# Altium project bt-fpc-pvt2.PrjPcb
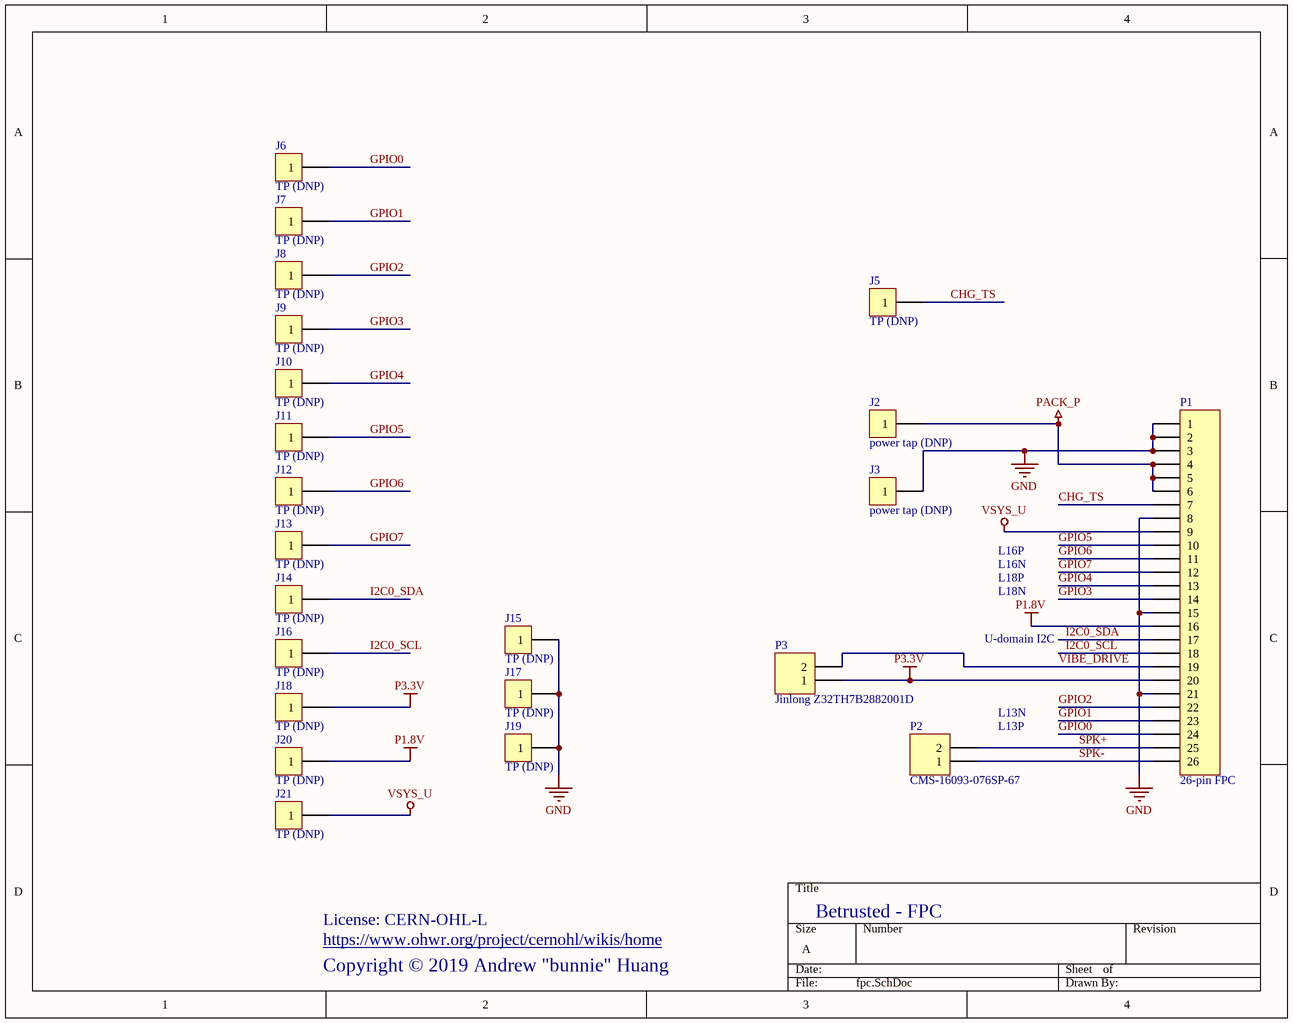
[diagram p0: fpc.SchDoc]
1 sheet, 22 parts. Net scope: global (net labels, ports and power ports of the same name join across sheets).
Board file: bt-fpc-pvt2b.PcbDoc

## Sheet fpc.SchDoc
size A

### Parts
J2  power tap (DNP)  [RESTAP-0603]
J3  power tap (DNP)  [RESTAP-0603]
J5  TP (DNP)  [TP_1.5x1_SMT]
J6  TP (DNP)  [TP_1.5x1_SMT]
J7  TP (DNP)  [TP_1.5x1_SMT]
J8  TP (DNP)  [TP_1.5x1_SMT]
J9  TP (DNP)  [TP_1.5x1_SMT]
J10  TP (DNP)  [TP_1.5x1_SMT]
J11  TP (DNP)  [TP_1.5x1_SMT]
J12  TP (DNP)  [TP_1.5x1_SMT]
J13  TP (DNP)  [TP_1.5x1_SMT]
J14  TP (DNP)  [TP_1.5x1_SMT]
J15  TP (DNP)  [TP_1.5x1_SMT]
J16  TP (DNP)  [TP_1.5x1_SMT]
J17  TP (DNP)  [TP_1.5x1_SMT]
J18  TP (DNP)  [TP_1.5x1_SMT]
J19  TP (DNP)  [TP_1.5x1_SMT]
J20  TP (DNP)  [TP_1.5x1_SMT]
J21  TP (DNP)  [TP_1.5x1_SMT]
P1  26-pin FPC  [HRS_FH34SRJ-26S-FPC-TOP]
P2  CMS-16093-076SP-67  [CUI_CMS-16093-076SP-67]
P3  Jinlong Z32TH7B2882001D  [JINLONG_Z32TH7B2882001D]

### Nets
GND: J3.1 J15.1 J17.1 J19.1 P1.1 P1.2 P1.3 P1.8 P1.15 P1.21
P1.8V: J20.1 P1.16
P3.3V: J18.1 P1.20 P3.1
PACK_P: J2.1 P1.4 P1.5 P1.6
VSYS_U: J21.1 P1.9
CHG_TS: J5.1 P1.7
GPIO0: J6.1 P1.24
GPIO1: J7.1 P1.23
GPIO2: J8.1 P1.22
GPIO3: J9.1 P1.14
GPIO4: J10.1 P1.13
GPIO5: J11.1 P1.10
GPIO6: J12.1 P1.11
GPIO7: J13.1 P1.12
I2C0_SCL: J16.1 P1.18
I2C0_SDA: J14.1 P1.17
SPK+: P1.25 P2.2
SPK-: P1.26 P2.1
VIBE_DRIVE: P1.19 P3.2

### Notes on the sheet
- L16P
- L16N
- U-domain I2C
- L18P
- L18N
- (near P2) L13P
- L13N
- License: CERN-OHL-L
- Copyright © 2019 Andrew "bunnie" Huang
- https://www.ohwr.org/project/cernohl/wikis/home
- Betrusted - FPC

### Library data of the parts
J2 J3 J5-J21 = CON1: Connector; MYPN: J-TP-PWRTAP-0603; MPN: DNP; VENDOR: DNP
P1 = FPC-26: 26 Pin FPC footprint; MPN: DNP; VENDOR: FPC pattern; System: Connector; MYPN: DNP
P2 = Header 2: MYPN: SPK-CMS-16093-076SP-67; VENDOR: CUI; LatestRevisionDate: 17-Jul-2002; LatestRevisionNote: Re-released for DXP Platform.; Publisher: Altium Limited; MPN: CMS-16093-076SP-67
P3 = Header 2: MYPN: M-JL-Z32TH7B2882001D; LatestRevisionDate: 17-Jul-2002; LatestRevisionNote: Re-released for DXP Platform.; Publisher: Altium Limited; MPN: Z32TH7B2882001D; VENDOR: Jinlong